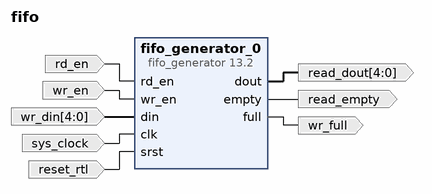
[diagram p0: block diagram of the top level]
# Vivado block design fifo, xc7z020clg400-1, Vivado 2018.3
create_bd_design fifo

create_bd_port -dir I -type rst reset_rtl
set_property -dict {CONFIG.POLARITY ACTIVE_HIGH} [get_bd_ports reset_rtl]
create_bd_port -dir I -type clk sys_clock
set_property -dict {CONFIG.FREQ_HZ 125000000 CONFIG.PHASE 0.000} [get_bd_ports sys_clock]
create_bd_port -dir O read_empty
create_bd_port -dir O -from 4 -to 0 read_dout
create_bd_port -dir I rd_en
create_bd_port -dir O wr_full
create_bd_port -dir I wr_en
create_bd_port -dir I -from 4 -to 0 wr_din

create_bd_cell -type ip -vlnv xilinx.com:ip:fifo_generator:13.2 fifo_generator_0
set_property -dict {CONFIG.Input_Data_Width 5 CONFIG.Input_Depth 16 CONFIG.Output_Data_Width 5} [get_bd_cells fifo_generator_0]

# ---- connections ----

connect_bd_net [get_bd_pins fifo_generator_0/empty] [get_bd_ports read_empty]
connect_bd_net [get_bd_pins fifo_generator_0/dout] [get_bd_ports read_dout]
connect_bd_net [get_bd_ports rd_en] [get_bd_pins fifo_generator_0/rd_en]
connect_bd_net [get_bd_pins fifo_generator_0/full] [get_bd_ports wr_full]
connect_bd_net [get_bd_ports wr_en] [get_bd_pins fifo_generator_0/wr_en]
connect_bd_net [get_bd_ports wr_din] [get_bd_pins fifo_generator_0/din]
connect_bd_net [get_bd_ports sys_clock] [get_bd_pins fifo_generator_0/clk]
connect_bd_net [get_bd_ports reset_rtl] [get_bd_pins fifo_generator_0/srst]

validate_bd_design
save_bd_design
